# Altium schematic sheet interface_pt1000.SchDoc
size A; SheetNumber: 18
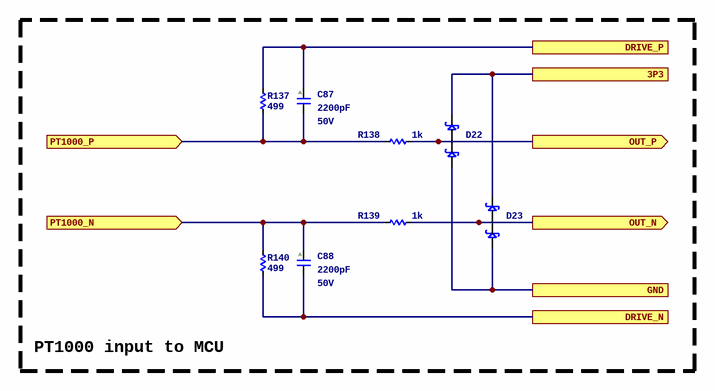
[diagram p0: interface_pt1000.SchDoc]

## Parts
C87  Capacitance: 2200pF  Voltage - Rated: 50V  [C0402_0.55MM]  (hidden comment: CGA2B2X7R1H222M050BA)
C88  Capacitance: 2200pF  Voltage - Rated: 50V  [C0402_0.55MM]  (hidden comment: CGA2B2X7R1H222M050BA)
D22  BAT54SLT1G  [3SOT23]  (value not drawn)
D23  BAT54SLT1G  [3SOT23]  (value not drawn)
R137  Resistance: 499  [R0402_0.40MM]  (hidden comment: ERJ-2RKF4990X)
R138  Resistance: 1k  [R0402_0.40MM]
R139  Resistance: 1k  [R0402_0.40MM]
R140  Resistance: 499  [R0402_0.40MM]  (hidden comment: ERJ-2RKF4990X)

## Blocks framed on the sheet
PT1000 input to MCU: C87 C88 D22 D23 R137-R140

## Ports
3P3, DRIVE_N, DRIVE_P, GND, OUT_N (out), OUT_P (out), PT1000_N (in), PT1000_P (in)

## Nets
3P3: D22.2 D23.2 ; port 3P3
DRIVE_N: C88.2 R140.2 ; port DRIVE_N
DRIVE_P: C87.1 R137.1 ; port DRIVE_P
GND: D22.1 D23.1 ; port GND
OUT_N: D23.3 R139.2 ; port OUT_N
OUT_P: D22.3 R138.2 ; port OUT_P
PT1000_N: C88.1 R139.1 R140.1 ; port PT1000_N
PT1000_P: C87.2 R137.2 R138.1 ; port PT1000_P

## Notes on the sheet
- (in symbol CGA2B2X7R1H222M050BA) A

## Library data of the parts
C87 C88 = CGA2B2X7R1H222M050BA: CAP CER 2200PF 50V X7R 0402; Manufacturer: TDK Corporation; Unit Price (USD): 0.1; Tolerance: ±20%; ComponentLink1URL: https://product.tdk.com/info/en/catalog/datasheets/mlcc_automotive_general_en.pdf?ref_disty=digikey; ComponentLink1Description: Series Datasheet; Series: CGA; Part Status: Active; Temperature Coefficient: X7R; Operating Temperature: -55°C ~ 125°C; Applications: AEC-Q200; Mounting Type: Surface Mount, MLCC; Package / Case: 0402 (1005 Metric); Size / Dimension: 0.039" L x 0.020" W (1.00mm x 0.50mm); Thickness (Max): 0.022" (0.55mm); Supplier 1: Digikey; Supplier Part Number 1: 445-12274-1-ND; Manufacturer Part Number: CGA2B2X7R1H222M050BA
D22 D23 = SCHOTTKY_30V_DUAL_BAT54SLT1G: DIODE SCHOTTKY DUAL 30V SOT23; Manufacturer: ON Semiconductor; Supplier 1: Digikey; Manufacturer Part Number: BAT54SLT1G; RoHS: RoHS Compliant; ComponentLink1URL: https://www.onsemi.com/pdf/datasheet/bat54slt1-d.pdf; ComponentLink1Description: Datasheet; Supplier Part Number 1: BAT54SLT1GOSCT-ND; Supplier 2: LCSC; Supplier Part Number 2: C19726
R137 R140 = ERJ-2RKF4990X: RES SMD 499 OHM 1% 1/10W 0402; Manufacturer: Panasonic Electronic Components; Unit Price (USD): 0.1; Power (Watts): 0.1W, 1/10W; Temperature Coefficient: ±100ppm/°C; ComponentLink1Description: Datasheet; ComponentLink1URL: https://industrial.panasonic.com/cdbs/www-data/pdf/RDA0000/AOA0000C304.pdf; Series: ERJ; Tolerance: ±1%; Composition: Thick Film; Features: Automotive AEC-Q200; Operating Temperature: -55°C ~ 155°C; Package / Case: 0402 (1005 Metric); Supplier Device Package: 0402; Size / Dimension: 0.039" L x 0.020" W (1.00mm x 0.50mm); Height - Seated (Max): 0.016" (0.40mm); Supplier 1: Digikey; Supplier Part Number 1: P499LCT-ND; Manufacturer Part Number: ERJ-2RKF4990X
R138 R139 = ERJ-2RKF1001X: RES SMD 1K OHM 1% 1/10W 0402; Manufacturer 1: Panasonic Electronic Components; Unit Price (USD): 0.1; Power (Watts): 0.1W, 1/10W; Temperature Coefficient: ±100ppm/°C; ComponentLink1Description: Datasheet; ComponentLink1URL: https://industrial.panasonic.com/cdbs/www-data/pdf/RDA0000/AOA0000C304.pdf; Series: ERJ; Tolerance: ±1%; Composition: Thick Film; Features: Automotive AEC-Q200; Operating Temperature: -55°C ~ 155°C; Package / Case: 0402 (1005 Metric); Supplier Device Package: 0402; Size / Dimension: 0.039" L x 0.020" W (1.00mm x 0.50mm); Height - Seated (Max): 0.016" (0.40mm); Manufacturer Part Number 1: ERJ-2RKF1001X; Supplier 1: Digikey; Supplier Part Number 1: P1.00KLCT-ND